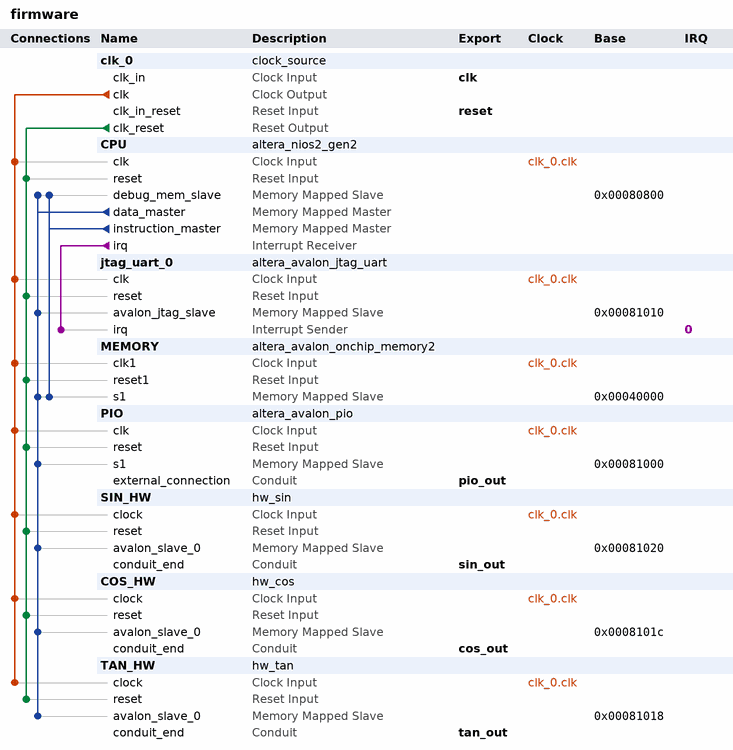
[diagram p0: system contents]
# Platform Designer (Qsys) system firmware, Cyclone V 5CSXFC6D6F31C6
# Parameters at their usual value, and those the tool derives, are not listed.
package require -exact qsys 18.1
create_system firmware
set_project_property DEVICE_FAMILY {Cyclone V}
set_project_property DEVICE 5CSXFC6D6F31C6

add_instance clk_0 clock_source 18.1
set_instance_parameter_value clk_0 clockFrequency 50000000

add_instance CPU altera_nios2_gen2 18.1
set_instance_parameter_value CPU dcache_size 2048
set_instance_parameter_value CPU exceptionSlave MEMORY.s1
set_instance_parameter_value CPU icache_size 4096
set_instance_parameter_value CPU impl Fast
set_instance_parameter_value CPU resetSlave MEMORY.s1

add_instance jtag_uart_0 altera_avalon_jtag_uart 18.1
set_instance_parameter_value jtag_uart_0 simInteractiveOptions NO_INTERACTIVE_WINDOWS

add_instance MEMORY altera_avalon_onchip_memory2 18.1
set_instance_parameter_value MEMORY dataWidth 32
set_instance_parameter_value MEMORY dualPort false
set_instance_parameter_value MEMORY initMemContent true
set_instance_parameter_value MEMORY initializationFileName onchip_mem.hex
set_instance_parameter_value MEMORY memorySize 204800

add_instance PIO altera_avalon_pio 18.1
set_instance_parameter_value PIO direction Output
set_instance_parameter_value PIO width 32

add_instance SIN_HW hw_sin 1.0

add_instance COS_HW hw_cos 1.0

add_instance TAN_HW hw_tan 1.0

# connections
add_connection clk_0.clk COS_HW.clock clock
add_connection clk_0.clk CPU.clk clock
add_connection clk_0.clk jtag_uart_0.clk clock
add_connection clk_0.clk MEMORY.clk1 clock
add_connection clk_0.clk PIO.clk clock
add_connection clk_0.clk SIN_HW.clock clock
add_connection clk_0.clk TAN_HW.clock clock
add_connection clk_0.clk_reset COS_HW.reset reset
add_connection clk_0.clk_reset CPU.reset reset
add_connection clk_0.clk_reset jtag_uart_0.reset reset
add_connection clk_0.clk_reset MEMORY.reset1 reset
add_connection clk_0.clk_reset PIO.reset reset
add_connection clk_0.clk_reset SIN_HW.reset reset
add_connection clk_0.clk_reset TAN_HW.reset reset
add_connection CPU.data_master COS_HW.avalon_slave_0 avalon
set_connection_parameter_value CPU.data_master/COS_HW.avalon_slave_0 baseAddress 0x0008101c
add_connection CPU.data_master CPU.debug_mem_slave avalon
set_connection_parameter_value CPU.data_master/CPU.debug_mem_slave baseAddress 0x00080800
add_connection CPU.data_master jtag_uart_0.avalon_jtag_slave avalon
set_connection_parameter_value CPU.data_master/jtag_uart_0.avalon_jtag_slave baseAddress 0x00081010
add_connection CPU.data_master MEMORY.s1 avalon
set_connection_parameter_value CPU.data_master/MEMORY.s1 baseAddress 0x00040000
add_connection CPU.data_master PIO.s1 avalon
set_connection_parameter_value CPU.data_master/PIO.s1 baseAddress 0x00081000
add_connection CPU.data_master SIN_HW.avalon_slave_0 avalon
set_connection_parameter_value CPU.data_master/SIN_HW.avalon_slave_0 baseAddress 0x00081020
add_connection CPU.data_master TAN_HW.avalon_slave_0 avalon
set_connection_parameter_value CPU.data_master/TAN_HW.avalon_slave_0 baseAddress 0x00081018
add_connection CPU.instruction_master CPU.debug_mem_slave avalon
set_connection_parameter_value CPU.instruction_master/CPU.debug_mem_slave baseAddress 0x00080800
add_connection CPU.instruction_master MEMORY.s1 avalon
set_connection_parameter_value CPU.instruction_master/MEMORY.s1 baseAddress 0x00040000
add_connection CPU.irq jtag_uart_0.irq interrupt
set_connection_parameter_value CPU.irq/jtag_uart_0.irq irqNumber 0

# exported interfaces
add_interface clk clock sink
set_interface_property clk EXPORT_OF clk_0.clk_in
add_interface cos_out conduit end
set_interface_property cos_out EXPORT_OF COS_HW.conduit_end
add_interface pio_out conduit end
set_interface_property pio_out EXPORT_OF PIO.external_connection
add_interface reset reset sink
set_interface_property reset EXPORT_OF clk_0.clk_in_reset
add_interface sin_out conduit end
set_interface_property sin_out EXPORT_OF SIN_HW.conduit_end
add_interface tan_out conduit end
set_interface_property tan_out EXPORT_OF TAN_HW.conduit_end

set_interconnect_requirement {$system} qsys_mm.clockCrossingAdapter HANDSHAKE
set_interconnect_requirement {$system} qsys_mm.enableEccProtection FALSE
set_interconnect_requirement {$system} qsys_mm.insertDefaultSlave FALSE
set_interconnect_requirement {$system} qsys_mm.maxAdditionalLatency 1

save_system firmware.qsys
